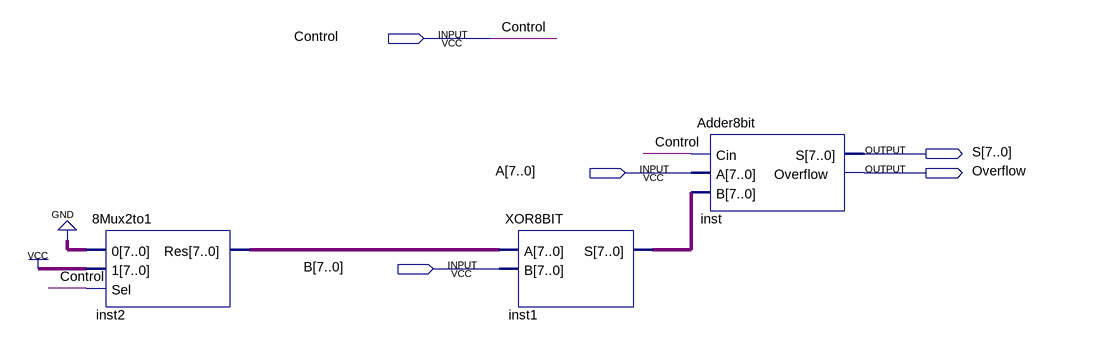
[diagram p0: schematic sheet]
// Quartus schematic ADDSUB.bdf as structural Verilog: 3 symbols, 5 pins
module ADDSUB (
  input  Control,
  input  [7:0] A,
  input  [7:0] B,
  output [7:0] S,
  output Overflow
);

  wire [7:0] inst1_s, inst2_res;

  \8Mux2to1  inst2 (.\0 ({8{1'b0}}), .\1 ({8{1'b1}}), .Sel(Control), .Res(inst2_res));
  XOR8BIT inst1 (.A(inst2_res), .B(B), .S(inst1_s));
  Adder8bit inst (.Cin(Control), .A(A), .B(inst1_s), .S(S), .Overflow(Overflow));
endmodule
